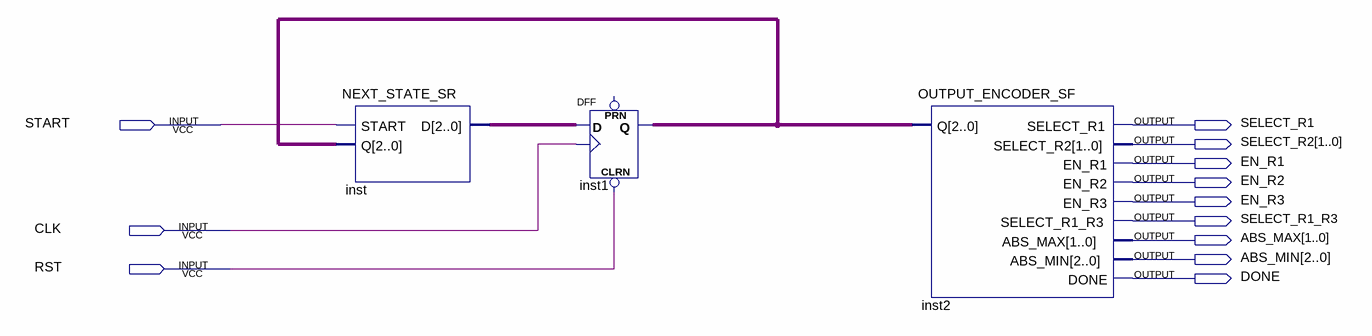
[diagram p0: schematic sheet]
// Quartus schematic CONTROLER_SF.bdf as structural Verilog: 3 symbols, 12 pins
module CONTROLER_SF (
  input  START,
  input  CLK,
  input  RST,
  output SELECT_R1,
  output [1:0] SELECT_R2,
  output EN_R1,
  output EN_R2,
  output EN_R3,
  output SELECT_R1_R3,
  output [1:0] ABS_MAX,
  output [2:0] ABS_MIN,
  output DONE
);

  wire [2:0] inst1_q, inst_d;

  NEXT_STATE_SR inst (.START(START), .Q(inst1_q), .D(inst_d));
  DFF inst1[2:0] (.CLRN(RST), .CLK(CLK), .D(inst_d), .Q(inst1_q));  // open: PRN
  OUTPUT_ENCODER_SF inst2 (
    .Q(inst1_q), .SELECT_R1(SELECT_R1), .SELECT_R2(SELECT_R2), .EN_R1(EN_R1), .EN_R2(EN_R2), .EN_R3(EN_R3),
    .SELECT_R1_R3(SELECT_R1_R3), .ABS_MAX(ABS_MAX), .ABS_MIN(ABS_MIN), .DONE(DONE));
endmodule
